# Altium project ExperimentBoard.PrjPcb
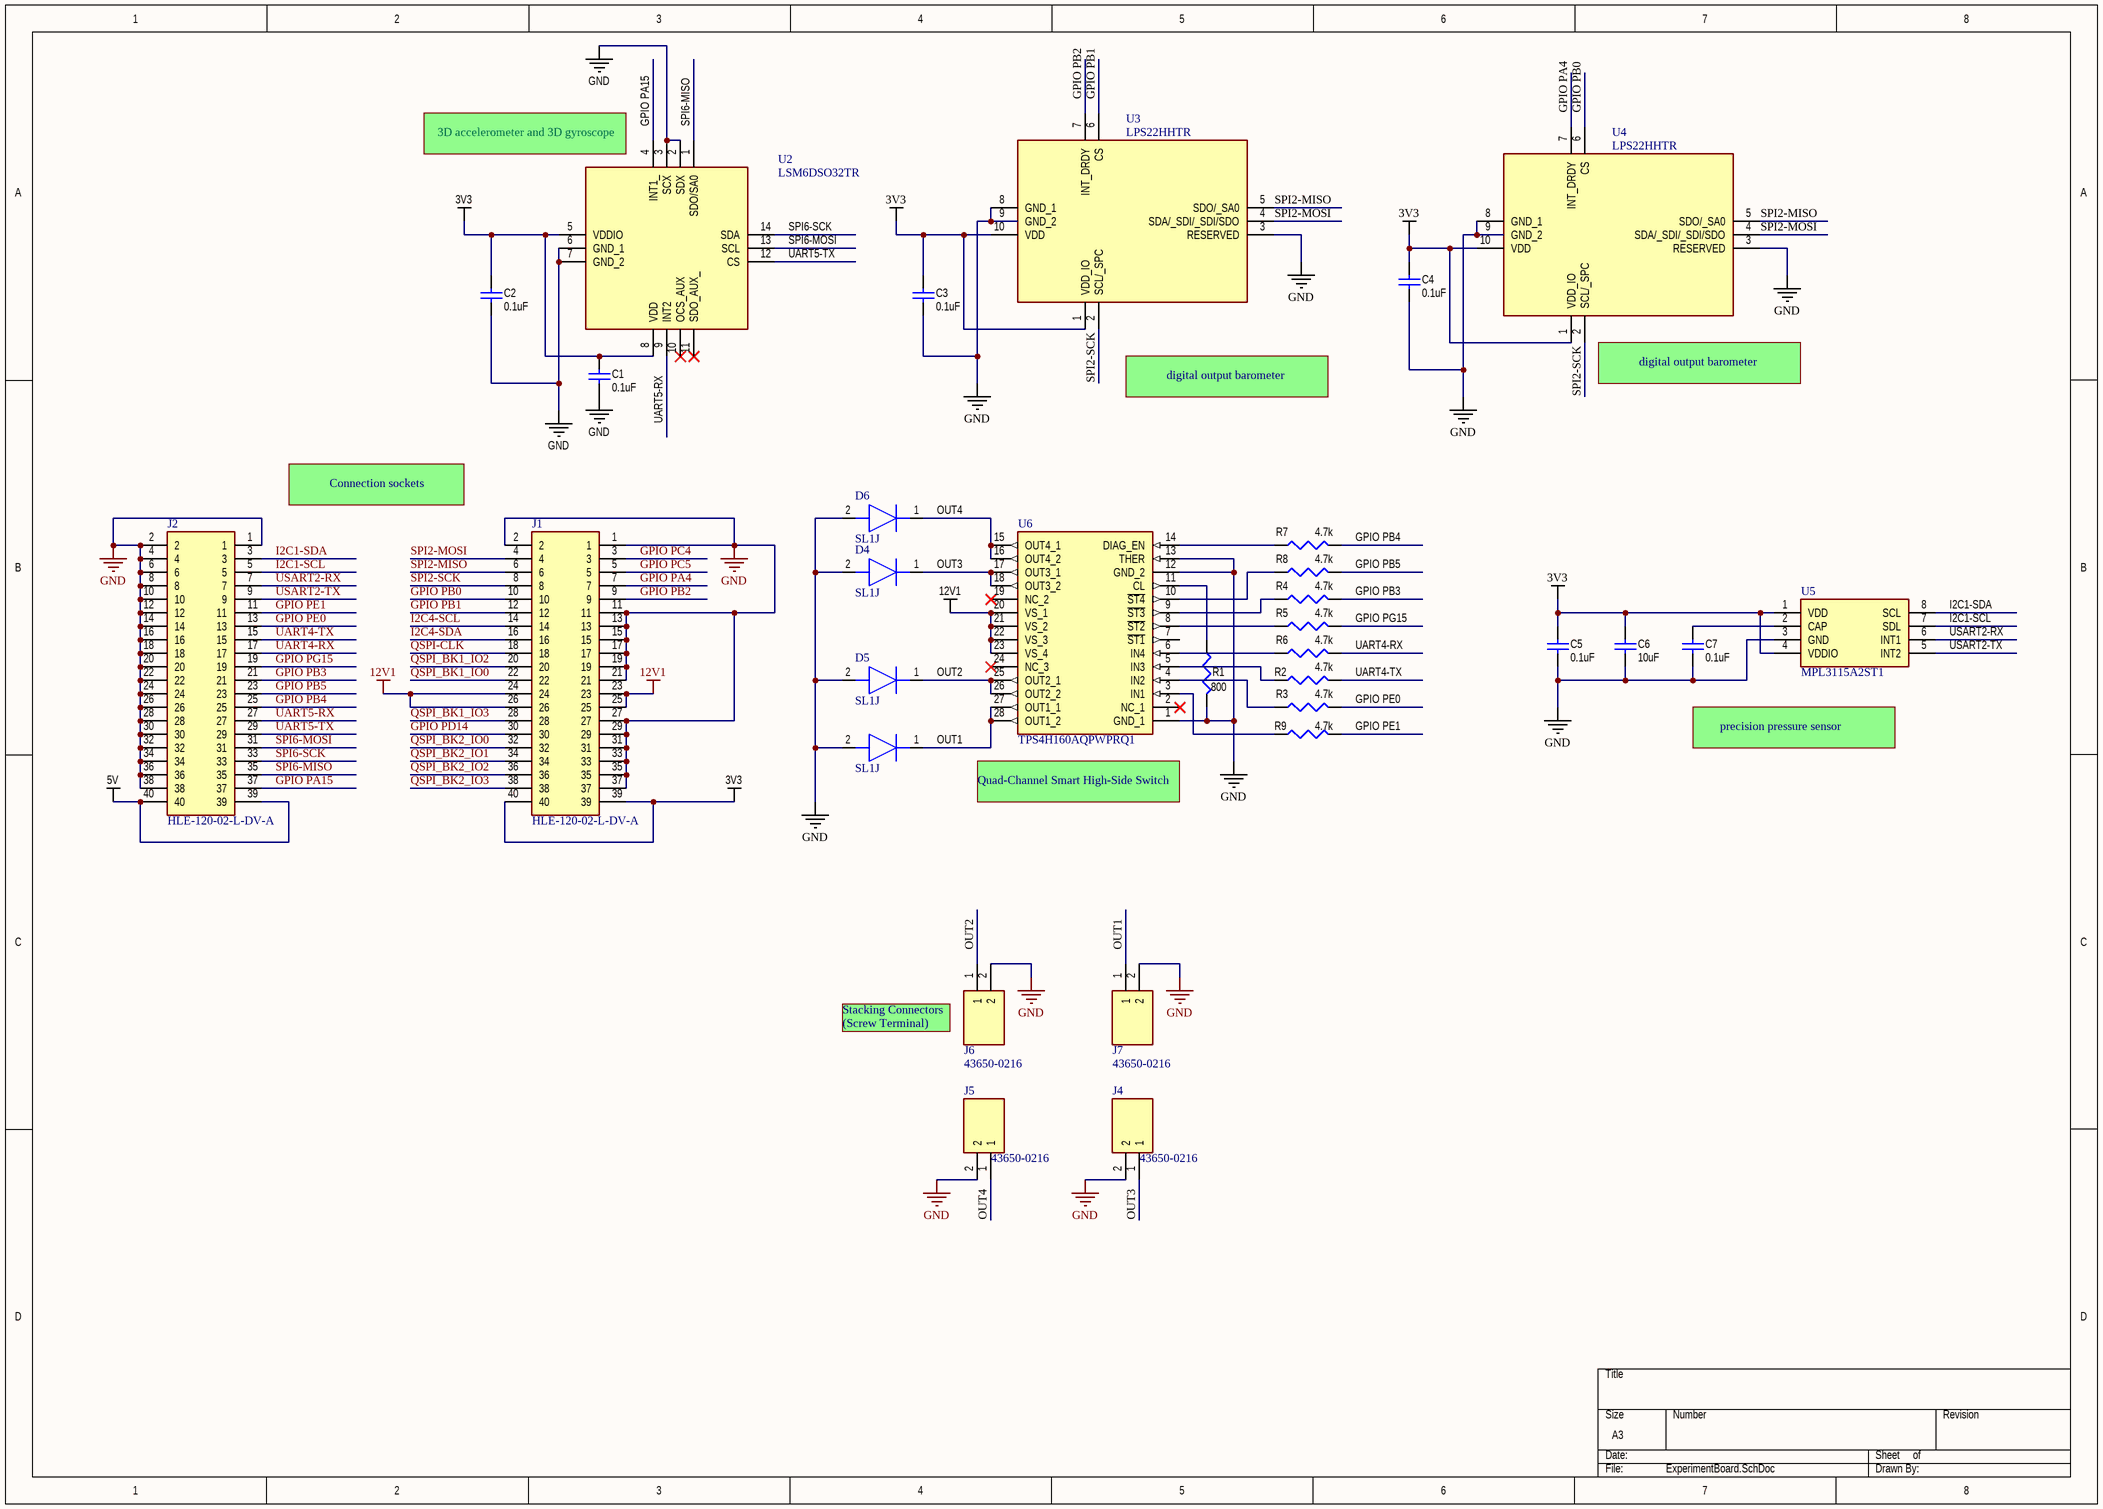
[diagram p0: ExperimentBoard.SchDoc]
1 sheet, 31 parts. Net scope: global (net labels, ports and power ports of the same name join across sheets).
Board file: ExperimentBoard.PcbDoc

## Sheet ExperimentBoard.SchDoc
size A3; SheetNumber: 1; SheetTotal: 1

### Parts
C1  0.1uF  [1608[0603]]
C2  0.1uF  [1608[0603]]
C3  0.1uF  [1608[0603]]
C4  0.1uF  [1608[0603]]
C5  0.1uF  [1608[0603]]
C6  10uF  [1608[0603]]
C7  0.1uF  [1608[0603]]
D4  SL1J  [SODFL3718X130N]
D5  SL1J  [SODFL3718X130N]
D6  SL1J  [SODFL3718X130N]
J1  HLE-120-02-L-DV-A  [HLE-120-02-XXX-DV-A]
J2  HLE-120-02-L-DV-A  [HLE-120-02-XXX-DV-A]
J4  43650-0216  [43650-02YY_151617]
J5  43650-0216  [43650-02YY_151617]
J6  43650-0216  [43650-02YY_151617]
J7  43650-0216  [43650-02YY_151617]
R1  800  [J1-0603]
R2  4.7k  [J1-0603]
R3  4.7k  [J1-0603]
R4  4.7k  [J1-0603]
R5  4.7k  [J1-0603]
R6  4.7k  [J1-0603]
R7  4.7k  [J1-0603]
R8  4.7k  [J1-0603]
R9  4.7k  [J1-0603]
U2  LSM6DSO32TR  [LSM6DSO]
U3  LPS22HHTR  [LPS22HHTR]
U4  LPS22HHTR  [LPS22HHTR]
U5  MPL3115A2ST1  [MPL3115A2R1]
U6  TPS4H160AQPWPRQ1  [SOP65P640X120-28N]
  SL1J  [SODFL3718X130N]

### Nets
3V3: C1.2 C2.2 C3.2 C4.2 C5.1 C6.1 J1.39 J1.40 U2.5(VDDIO) U2.8(VDD) U3.1(VDD_IO) U3.10(VDD) U4.1(VDD_IO) U4.10(VDD) U5.1(VDD) U5.4(VDDIO)
5V: J2.39 J2.40
12V1: J1.23 J1.24 J1.25 J1.26 U6.20(VS_1) U6.21(VS_2) U6.22(VS_3) U6.23(VS_4)
GND: C1.1 C2.1 C3.1 C4.1 C5.2 C6.2 C7.2 D4.2(A) D5.2(A) D6.2(A) J1.1 J1.2 J1.11 J1.13 J1.15 J1.17 J1.19 J1.21 J1.27 J1.29 J1.31 J1.33 J1.35 J1.37 J2.1 J2.2 J2.4 J2.6 J2.8 J2.10 J2.12 J2.14 J2.16 J2.18 J2.20 J2.22 J2.24 J2.26 J2.28 J2.30 J2.32 J2.34 J2.36 J2.38 J4.2 J5.2 J6.2 J7.2 R1.2 U2.2(SDX) U2.3(SCX) U2.6(GND_1) U2.7(GND_2) U3.3(RESERVED) U3.8(GND_1) U3.9(GND_2) U4.3(RESERVED) U4.8(GND_1) U4.9(GND_2) U5.3(GND) U6.1(GND_1) U6.12(GND_2) U6.13(THER) .2(A)
GPIO PA4: J1.7 U4.7(INT_DRDY)
GPIO PA15: J2.37 U2.4(INT1_)
GPIO PB0: J1.10 U4.6(CS)
GPIO PB1: J1.12 U3.6(CS)
GPIO PB2: J1.9 U3.7(INT_DRDY)
GPIO PB3: J2.21 R4.2
GPIO PB4: J2.25 R7.2
GPIO PB5: J2.23 R8.2
GPIO PC4: J1.3
GPIO PC5: J1.5
GPIO PD14: J1.30
GPIO PE0: J2.13 R3.2
GPIO PE1: J2.11 R9.2
GPIO PG15: J2.19 R5.2
I2C1-SCL: J2.5 U5.7(SDL)
I2C1-SDA: J2.3 U5.8(SCL)
I2C4-SCL: J1.14
I2C4-SDA: J1.16
OUT1: J7.1 U6.27(OUT1_1) U6.28(OUT1_2) .1(K)
OUT2: D5.1(K) J6.1 U6.25(OUT2_1) U6.26(OUT2_2)
OUT3: D4.1(K) J4.1 U6.17(OUT3_1) U6.18(OUT3_2)
OUT4: D6.1(K) J5.1 U6.15(OUT4_1) U6.16(OUT4_2)
QSPI-CLK: J1.18
QSPI_BK1_IO0: J1.22
QSPI_BK1_IO2: J1.20
QSPI_BK1_IO3: J1.28
QSPI_BK2_IO0: J1.32
QSPI_BK2_IO1: J1.34
QSPI_BK2_IO2: J1.36
QSPI_BK2_IO3: J1.38
SPI2-MISO: J1.6 U3.5(SDO/_SA0) U4.5(SDO/_SA0)
SPI2-MOSI: J1.4 U3.4(SDA/_SDI/_SDI/SDO) U4.4(SDA/_SDI/_SDI/SDO)
SPI2-SCK: J1.8 U3.2(SCL/_SPC) U4.2(SCL/_SPC)
SPI6-MISO: J2.35 U2.1(SDO/SA0)
SPI6-MOSI: J2.31 U2.13(SCL)
SPI6-SCK: J2.33 U2.14(SDA)
UART4-RX: J2.17 R6.2
UART4-TX: J2.15 R2.2
UART5-RX: J2.27 U2.9(INT2)
UART5-TX: J2.29 U2.12(CS)
USART2-RX: J2.7 U5.6(INT1)
USART2-TX: J2.9 U5.5(INT2)
NetC7_1: C7.1 U5.2(CAP)
NetR1_1: R1.1 U6.11(CL)
NetR2_1: R2.1 U6.5(IN3)
NetR3_1: R3.1 U6.4(IN2)
NetR4_1: R4.1 U6.9(~{ST3})
NetR5_1: R5.1 U6.8(~{ST2})
NetR6_1: R6.1 U6.6(IN4)
NetR7_1: R7.1 U6.14(DIAG_EN)
NetR8_1: R8.1 U6.10(~{ST4})
NetR9_1: R9.1 U6.3(IN1)

Not connected (* = marked no-connect by the designer): U2 10(OCS_AUX)* 11(SDO_AUX_)*; U6 2(NC_1)* 7(~{ST1}) 19(NC_2)* 24(NC_3)*

### Notes on the sheet
- (near U2) 3D accelerometer and 3D gyroscope
- digital output barometer
- (near U4) digital output barometer
- Connection sockets
- Quad-Channel Smart High-Side Switch
- precision pressure sensor
- (near J6) Stacking Connectors
- (near J6) (Screw Terminal)

### Library data of the parts
C1-C5 C7 = Cap: Capacitor; Published: 8-Jun-2000; LatestRevisionDate: 17-Jul-2002; LatestRevisionNote: Re-released for DXP Platform.; PackageReference: RAD-0.3; Publisher: Altium Limited; PackageDescription: Radial Cap, Thru-Hole; 2 Leads; 0.3 in Pin Spacing; Value: 0.1uF
C6 = Cap: Capacitor; Value: 0.1uF; Published: 8-Jun-2000; LatestRevisionDate: 17-Jul-2002; LatestRevisionNote: Re-released for DXP Platform.; PackageReference: RAD-0.3; Publisher: Altium Limited; PackageDescription: Radial Cap, Thru-Hole; 2 Leads; 0.3 in Pin Spacing
D4-D6  = SL1J: Diode; Manufacturer_Name: Diotec; Datasheet Link: https://diotec.com/request/datasheet/sl1a.pdf; Height: 1.3mm; Manufacturer_Part_Number: SL1J; Mouser Part Number: 637-SL1J; Mouser Price/Stock: https://www.mouser.co.uk/ProductDetail/Diotec-Semiconductor/SL1J?qs=OlC7AqGiEDm%2FUyNJqMVviA%3D%3D; Arrow Part Number: SL1J; Arrow Price/Stock: https://www.arrow.com/en/products/sl1j/diotec-semiconductor-ag?region=europe
J1 J2 = HLE-120-02-L-DV-A: Connector; Manufacturer_Name: SAMTEC; Datasheet Link: http://suddendocs.samtec.com/prints/hle-1xx-02-xxx-dv-xx-xx-xx-mkt.pdf; Manufacturer_Part_Number: HLE-120-02-L-DV-A; Mouser Part Number: 200-HLE12002LDVA; Mouser Price/Stock: https://www.mouser.co.uk/ProductDetail/Samtec/HLE-120-02-L-DV-A?qs=0lQeLiL1qyZq0rwGrAI%2FeQ%3D%3D; Arrow Part Number: HLE-120-02-L-DV-A; Arrow Price/Stock: https://www.arrow.com/en/products/hle-120-02-l-dv-a/samtec?region=nac
J4-J7 = 43650-0216: Connector; Manufacturer_Name: Molex; Datasheet Link: https://www.molex.com/pdm_docs/sd/436500215_sd.pdf; Height: 9.9mm; Manufacturer_Part_Number: 43650-0216; Mouser Part Number: 538-43650-0216; Mouser Price/Stock: https://www.mouser.co.uk/ProductDetail/Molex/43650-0216?qs=EeaHXY5iaaOSmxGRwEX9Ng%3D%3D
R1-R9 = Res3: Resistor; Value: 1K; Published: 8-Jun-2000; LatestRevisionDate: 29-May-2009; LatestRevisionNote: IPC-7351 Footprint Added.; PackageReference: J1-0603; Publisher: Altium Limited; PackageDescription: Chip Resistor
U2 = LSM6DSO: Accelerometer; Manufacturer_Name: STMicroelectronics; Datasheet Link: https://www.st.com/en/mems-and-sensors/lsm6dso.html; Height: 0.86mm; Manufacturer_Part_Number: LSM6DSO; Mouser Part Number: N/A; Mouser Price/Stock: https://www.mouser.co.uk/ProductDetail/STMicroelectronics/LSM6DSO?qs=lc2O%252BfHJPVaWmEJZZeO%252B0w%3D%3D
U3 U4 = LPS22HHTR: Integrated Circuit; Manufacturer_Name: STMicroelectronics; Datasheet Link: https://www.st.com/resource/en/datasheet/lps22hh.pdf; Height: 0.8mm; Manufacturer_Part_Number: LPS22HHTR; Mouser Part Number: 511-LPS22HHTR; Mouser Price/Stock: https://www.mouser.co.uk/ProductDetail/STMicroelectronics/LPS22HHTR?qs=lc2O%252BfHJPVbKAkJQGWFcLg%3D%3D; Arrow Part Number: LPS22HHTR; Arrow Price/Stock: https://www.arrow.com/en/products/lps22hhtr/stmicroelectronics?region=europe
U5 = MPL3115A2R1: Integrated Circuit; Manufacturer_Name: NXP; Datasheet Link: http://www.nxp.com/docs/en/data-sheet/MPL3115A2.pdf; Height: 1.2mm; Manufacturer_Part_Number: MPL3115A2R1; Mouser Part Number: 841-MPL3115A2R1; Mouser Price/Stock: https://www.mouser.co.uk/ProductDetail/NXP-Semiconductors/MPL3115A2R1?qs=6ddF3R%2F6EV%2Fx8daKoNGetQ%3D%3D; Arrow Part Number: MPL3115A2R1; Arrow Price/Stock: https://www.arrow.com/en/products/mpl3115a2r1/nxp-semiconductors?region=nac
U6 = TPS4H160AQPWPRQ1: Switch; Manufacturer_Name: Texas Instruments; Datasheet Link: http://www.ti.com/lit/gpn/tps4h160-q1; Height: 1.2mm; Manufacturer_Part_Number: TPS4H160AQPWPRQ1; Mouser Part Number: 595-TPS4H160AQPWPRQ1; Mouser Price/Stock: https://www.mouser.co.uk/ProductDetail/Texas-Instruments/TPS4H160AQPWPRQ1?qs=l4JqiU1WKg3jmTHCrG9xTw%3D%3D; Arrow Part Number: TPS4H160AQPWPRQ1; Arrow Price/Stock: https://www.arrow.com/en/products/tps4h160aqpwprq1/texas-instruments?region=nac